# EAGLE schematic E-Piano (EAGLE 9.2.2)
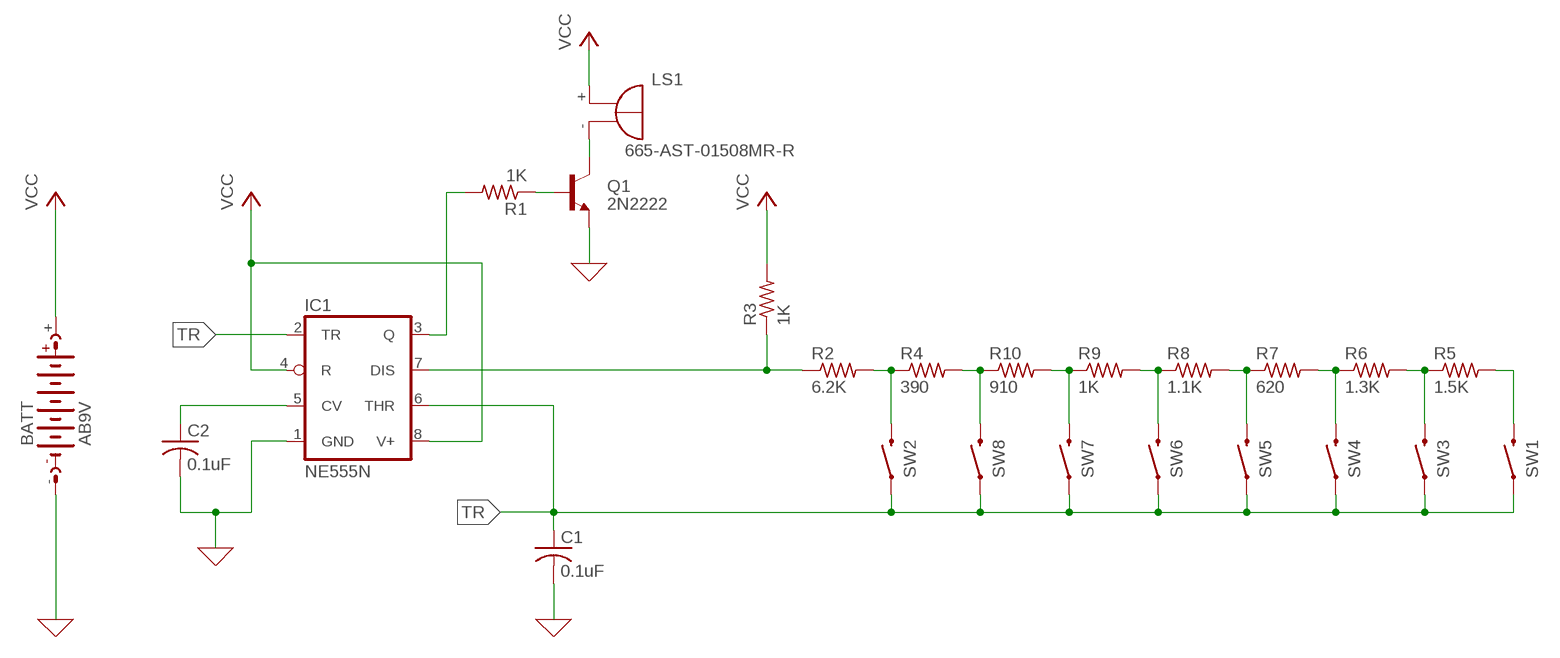
[diagram p0: schematic, sheet 1]

## Parts
BATT  AB9V  [AB9V]
C1  0.1uF  C-US025-025X050  [C025-025X050]
C2  0.1uF  C-US025-025X050  [C025-025X050]
IC1  NE555N  [DIL08]
LS1  F/HMB  [F/HMB]
Q1  2N2222  -NPN-TO92-E1  [TO92-E1]
R1  1K  R-US_0207/10  [0207/10]
R2  6.2K  R-US_0207/10  [0207/10]
R3  1K  R-US_0207/10  [0207/10]
R4  390  R-US_0207/10  [0207/10]
R5  1.5K  R-US_0207/10  [0207/10]
R6  1.3K  R-US_0207/10  [0207/10]
R7  620  R-US_0207/10  [0207/10]
R8  1.1K  R-US_0207/10  [0207/10]
R9  1K  R-US_0207/10  [0207/10]
R10  910  R-US_0207/10  [0207/10]
SW1  MOMENTARY-SWITCH-SPST-PTH-6.0MM  [TACTILE_SWITCH_PTH_6.0MM]
SW2  MOMENTARY-SWITCH-SPST-PTH-6.0MM  [TACTILE_SWITCH_PTH_6.0MM]
SW3  MOMENTARY-SWITCH-SPST-PTH-6.0MM  [TACTILE_SWITCH_PTH_6.0MM]
SW4  MOMENTARY-SWITCH-SPST-PTH-6.0MM  [TACTILE_SWITCH_PTH_6.0MM]
SW5  MOMENTARY-SWITCH-SPST-PTH-6.0MM  [TACTILE_SWITCH_PTH_6.0MM]
SW6  MOMENTARY-SWITCH-SPST-PTH-6.0MM  [TACTILE_SWITCH_PTH_6.0MM]
SW7  MOMENTARY-SWITCH-SPST-PTH-6.0MM  [TACTILE_SWITCH_PTH_6.0MM]
SW8  MOMENTARY-SWITCH-SPST-PTH-6.0MM  [TACTILE_SWITCH_PTH_6.0MM]

## Nets
0: BATT.- C1.2 C2.2 IC1.1(GND) ; supply symbol labelled GND
GND: Q1.3(E)
N$1: R2.2 R4.1 SW2.3
N$2: IC1.7(DIS) R2.1 R3.1
N$4: R4.2 R10.1 SW8.3
N$5: R9.1 R10.2 SW7.3
N$6: R8.1 R9.2 SW6.3
N$7: R7.1 R8.2 SW5.3
N$8: R6.1 R7.2 SW4.3
N$9: R5.1 R6.2 SW3.3
N$10: R5.2 SW1.3
N$11: IC1.3(Q) R1.2
N$12: C2.1 IC1.5(CV)
N$13: LS1.- Q1.1(C)
N$14: Q1.2(B) R1.1
TR: C1.1 IC1.2(TR) IC1.6(THR) SW1.1 SW2.1 SW3.1 SW4.1 SW5.1 SW6.1 SW7.1 SW8.1
VCC: BATT.+ IC1.4(R) IC1.8(V+) LS1.+ R3.2

## Library data of the parts
BATT = battery:AB9V: 9-V BATTERY CLIP
C1 C2 = rcl:C-US: CAPACITOR, American symbol; MOUSER#: 581-SR201C104KARTR1; OC_NEWARK: unknown; SPICEPREFIX: C
IC1 = linear:*555: TIMER; MOUSER#: 595-TLC555CP; MPN: TLC555CP; OC_NEWARK: 24M8296
LS1 = buzzer:F/HMB: BUZZER Source: Buerklin; MOUSER#: 665-AST-01508MR-R; OC_FARNELL: unknown; OC_NEWARK: unknown
Q1 = transistor:*-NPN-: NPN Transistror BF959 corrected 2008.03.06; MF: FAIRCHILD SEMICONDUCTOR; MOUSER#: 833-PN2222A-AP; MPN: PN2222ATF; OC_NEWARK: 58K2048
R1 R3 R9 = rcl:R-US_: RESISTOR, American symbol; MOUSER#: 660-MF1/4DCT26A1001F; OC_NEWARK: unknown; SPICEPREFIX: R
R2 = rcl:R-US_: RESISTOR, American symbol; MOUSER#: 603-MFR-25FRF52-6K2; OC_NEWARK: unknown; SPICEPREFIX: R
R4 = rcl:R-US_: RESISTOR, American symbol; MOUSER#: 603-MFR-25FTE52-390R; OC_NEWARK: unknown; SPICEPREFIX: R
R5 = rcl:R-US_: RESISTOR, American symbol; MOUSER#: 603-MFR-25FBF52-1K5; OC_NEWARK: unknown; SPICEPREFIX: R
R6 = rcl:R-US_: RESISTOR, American symbol; MOUSER#: 603-MFR-25FBF52-1K3; OC_NEWARK: unknown; SPICEPREFIX: R
R7 = rcl:R-US_: RESISTOR, American symbol; MOUSER#: 603-MFR-25FBF52-620R; OC_NEWARK: unknown; SPICEPREFIX: R
R8 = rcl:R-US_: RESISTOR, American symbol; MOUSER#: 603-MFR-25FBF52-1K1; OC_NEWARK: unknown; SPICEPREFIX: R
R10 = rcl:R-US_: RESISTOR, American symbol; MOUSER#: 603-MFR-25FRF52-910R; OC_NEWARK: unknown; SPICEPREFIX: R
SW1-SW8 = SparkFun-Switches:MOMENTARY-SWITCH-SPST: Momentary Switch (Pushbutton) - SPST Normally-open (NO) SPST momentary switches (buttons, pushbuttons). Variants PTH-12MM - 12mm square, through-hole Momentary Pushbutton Switch - 12mm Square <https://www.sparkfun.com/products/9190> (COM-09190) PTH-6.0MM, PTH-6.0MM-KIT - 6.0mm square, through-hole Mini Pushbutton Switch <https://www.sparkfun.com/products/97> (COM-00097) KIT package intended for soldering kit's - only one side of pads' copper is exposed. PTH-RIGHT-ANGLE-KIT - Right-angle, through-hole Right Angle Tactile Button <https://www.sparkfun.com/products/10791> - Used on SparkFun BigTime Watch Kit <https://www.sparkfun.com/products/11734> SMD-12MM - 12mm square, surface-mount Tactile Button - SMD (12mm) <https://www.sparkfun.com/products/12993> (COM-12993) Used on SparkFun PicoBoard <https://www.sparkfun.com/products/11888> SMD-4.5MM - 4.5mm Square Trackball Switch Used on SparkFun Blackberry Trackballer Breakout <https://www.sparkfun.com/products/13169> SMD-4.6MMX2.8MM - 4.60mm x 2.80mm, surface mount Used on SparkFun SAMD21 Mini Breakout <https://www.sparkfun.com/products/13664> SMD-5.2MM, SMD-5.2-REDUNDANT - 5.2mm square, surface-mount Mini Pushbutton Switch - SMD <https://www.sparkfun.com/products/8720> (COM-08720) Used on Arduino Pro Mini <https://www.sparkfun.com/products/11114> REDUNDANT package connects both switch circuits together SMD-6.0X3.5MM - 6.0 x 3.5mm, surface mount Momentary Reset Switch SMD <https://www.sparkfun.com/products/8229> (COM-08229) SMD-6.2MM-TALL - 6.2mm square, surface mount Tactile Button - SMD (6mm) <https://www.sparkfun.com/products/12992> Used on SparkFun Digital Sandbox <https://www.sparkfun.com/products/12651> SMD-RIGHT-ANGLE - Right-angle, surface mount Used on SparkFun Block for Intel® Edison - Arduino <https://www.sparkfun.com/products/13036>; MOUSER#: 653-B3F-1000; OC_NEWARK: unknown; PROD_ID: SWCH-08441; SF_SKU: COM-00097

## Net classes
0 default: width 0.305 mm, drill 0.508 mm, clearance 0.254 mm